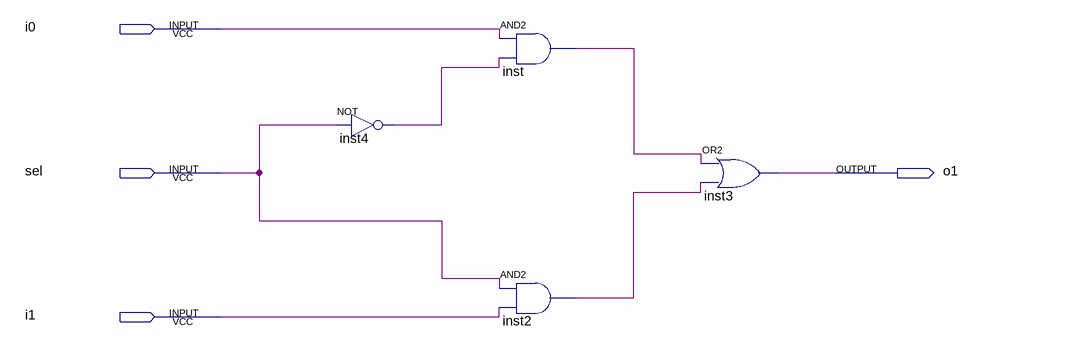
[diagram p0: schematic sheet]
// Quartus schematic mux_2.bdf as structural Verilog: 4 symbols, 4 pins
module mux_2 (
  input  i0,
  input  sel,
  input  i1,
  output o1
);

  wire inst2_out, inst4_out, inst_out;

  not inst4 (inst4_out, sel);
  and inst (inst_out, i0, inst4_out);
  and inst2 (inst2_out, sel, i1);
  or inst3 (o1, inst_out, inst2_out);
endmodule
